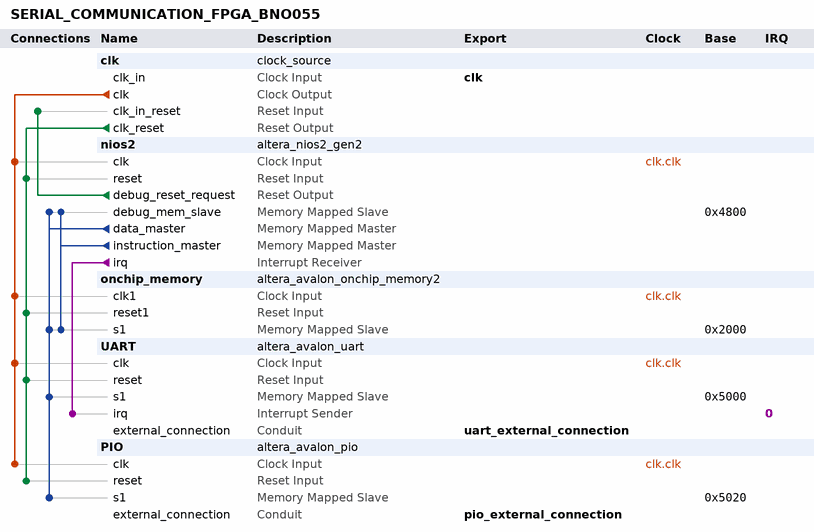
[diagram p0: system contents]
# Platform Designer (Qsys) system SERIAL_COMMUNICATION_FPGA_BNO055, Cyclone IV E Unknown
# Parameters at their usual value, and those the tool derives, are not listed.
package require -exact qsys 15.0
create_system SERIAL_COMMUNICATION_FPGA_BNO055
set_project_property DEVICE_FAMILY {Cyclone IV E}
set_project_property DEVICE Unknown

add_instance clk clock_source 15.0
set_instance_parameter_value clk clockFrequency 50000000

add_instance nios2 altera_nios2_gen2 15.0
set_instance_parameter_value nios2 dcache_size 2048
set_instance_parameter_value nios2 exceptionSlave onchip_memory.s1
set_instance_parameter_value nios2 icache_size 4096
set_instance_parameter_value nios2 impl Fast
set_instance_parameter_value nios2 resetSlave onchip_memory.s1

add_instance onchip_memory altera_avalon_onchip_memory2 15.0
set_instance_parameter_value onchip_memory dataWidth 32
set_instance_parameter_value onchip_memory dualPort false
set_instance_parameter_value onchip_memory initMemContent true
set_instance_parameter_value onchip_memory initializationFileName onchip_mem.hex
set_instance_parameter_value onchip_memory memorySize 8192

add_instance UART altera_avalon_uart 15.0
set_instance_parameter_value UART baud 115200
set_instance_parameter_value UART dataBits 8
set_instance_parameter_value UART fixedBaud true
set_instance_parameter_value UART parity NONE
set_instance_parameter_value UART stopBits 1

add_instance PIO altera_avalon_pio 15.0
set_instance_parameter_value PIO direction Output
set_instance_parameter_value PIO width 8

# connections
add_connection clk.clk nios2.clk clock
add_connection clk.clk onchip_memory.clk1 clock
add_connection clk.clk PIO.clk clock
add_connection clk.clk UART.clk clock
add_connection clk.clk_reset nios2.reset reset
add_connection clk.clk_reset onchip_memory.reset1 reset
add_connection clk.clk_reset PIO.reset reset
add_connection clk.clk_reset UART.reset reset
add_connection nios2.debug_reset_request clk.clk_in_reset reset
add_connection nios2.data_master nios2.debug_mem_slave avalon
set_connection_parameter_value nios2.data_master/nios2.debug_mem_slave baseAddress 0x4800
add_connection nios2.data_master onchip_memory.s1 avalon
set_connection_parameter_value nios2.data_master/onchip_memory.s1 baseAddress 0x2000
add_connection nios2.data_master PIO.s1 avalon
set_connection_parameter_value nios2.data_master/PIO.s1 baseAddress 0x5020
add_connection nios2.data_master UART.s1 avalon
set_connection_parameter_value nios2.data_master/UART.s1 baseAddress 0x5000
add_connection nios2.instruction_master nios2.debug_mem_slave avalon
set_connection_parameter_value nios2.instruction_master/nios2.debug_mem_slave baseAddress 0x4800
add_connection nios2.instruction_master onchip_memory.s1 avalon
set_connection_parameter_value nios2.instruction_master/onchip_memory.s1 baseAddress 0x2000
add_connection nios2.irq UART.irq interrupt
set_connection_parameter_value nios2.irq/UART.irq irqNumber 0

# exported interfaces
add_interface clk clock sink
set_interface_property clk EXPORT_OF clk.clk_in
add_interface pio_external_connection conduit end
set_interface_property pio_external_connection EXPORT_OF PIO.external_connection
add_interface uart_external_connection conduit end
set_interface_property uart_external_connection EXPORT_OF UART.external_connection

set_interconnect_requirement {$system} qsys_mm.clockCrossingAdapter HANDSHAKE
set_interconnect_requirement {$system} qsys_mm.enableEccProtection FALSE
set_interconnect_requirement {$system} qsys_mm.insertDefaultSlave FALSE
set_interconnect_requirement {$system} qsys_mm.maxAdditionalLatency 1

save_system SERIAL_COMMUNICATION_FPGA_BNO055.qsys
